# Altium schematic sheet can.SchDoc
size A4
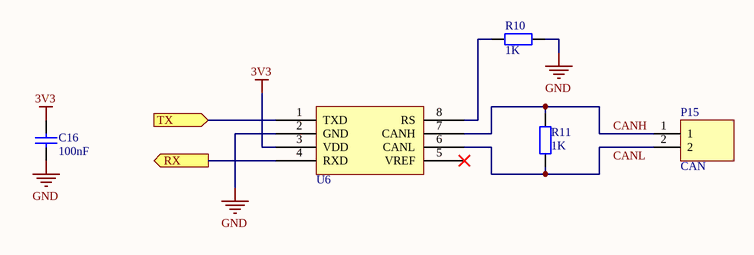
[diagram p0: can.SchDoc]

## Parts
C16  100nF  [FP_0805_CAP_085]
P15  CAN  [FP_CONN2_TAP_254MM_90_NOPRINT]
R10  1K  [FP_0805_RES]
R11  value 1K  [FP_0805_RES]  (hidden comment: 120R)
U6  MCP2551  [SOIC8]  (value not drawn)

## Ports
RX (out), TX (in)

## Nets
3V3: C16.2 U6.3(VDD)
GND: C16.1 R10.1 U6.2(GND)
CANH: P15.1 R11.2 U6.7(CANH)
CANL: P15.2 R11.1 U6.6(CANL)
RX: U6.4(RXD) ; port RX
TX: U6.1(TXD) ; port TX
NetR10_2: R10.2 U6.8(RS)

Not connected (* = marked no-connect by the designer): U6 5(VREF)*

## Library data of the parts
C16 = CAP: Capacitor; Value: 100nF
P15 = Connector_2pin: 2pin connector
R10 R11 = RES: Resistor
  R10: Value: 1K
U6 = MCP2551: CAN Driver IC